# Altium schematic sheet UserInterface.SchDoc
size A
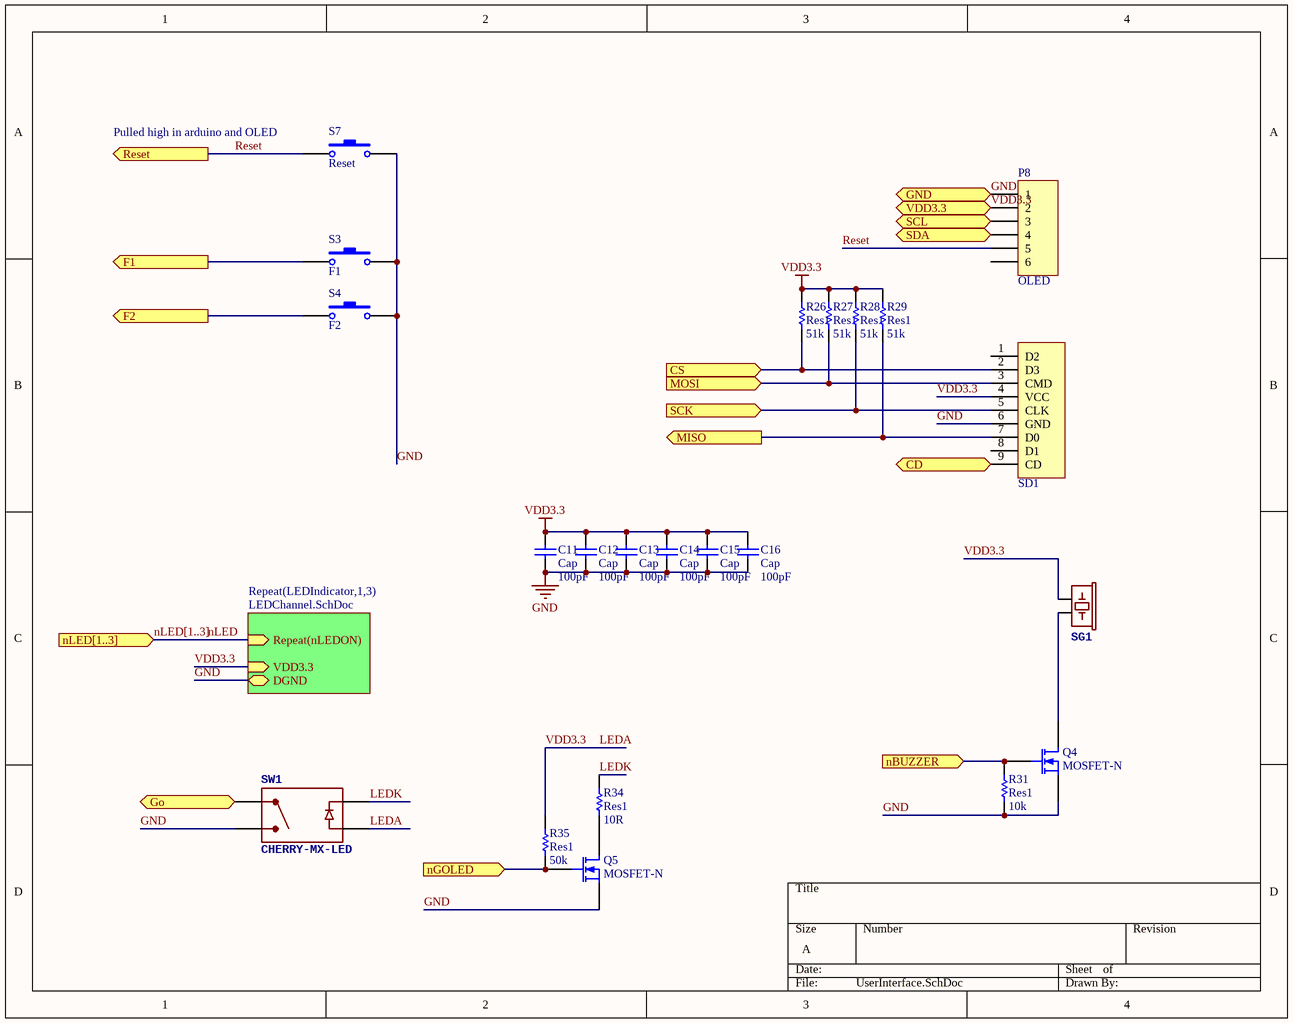
[diagram p0: UserInterface.SchDoc]

## Parts
C11  Cap  value 100pF  [CAP_0805]
C12  Cap  value 100pF  [CAP_0805]
C13  Cap  value 100pF  [CAP_0805]
C14  Cap  value 100pF  [CAP_0805]
C15  Cap  value 100pF  [CAP_0805]
C16  Cap  value 100pF  [CAP_0805]
P8  OLED  [OLEd]
Q4  MOSFET-N  [SOT23-3]
Q5  MOSFET-N  [SOT23-3]
R26  Res1  value 51k  [RES_0805]
R27  Res1  value 51k  [RES_0805]
R28  Res1  value 51k  [RES_0805]
R29  Res1  value 51k  [RES_0805]
R31  Res1  value 10k  [RES_0805]
R34  Res1  value 10R  [RES_0805]
R35  Res1  value 50k  [RES_0805]
S3  F1  [ButtonTACT_3x6x2.5_180]
S4  F2  [ButtonTACT_3x6x2.5_180]
S7  Reset  [ButtonTACT_3x6x2.5_180]
SD1  SD_Card_TF  [SD_Card_TF]  (value not drawn)
SG1  Buzzer 12mmSpark Fun Electronics SKU : Comp-Buzzer  [Buzzer_5x5]  (value not drawn)
SW1  CHERRY-MX-LED  [MX-LED]

## Sub-sheets
Repeat(LEDIndicator,1,3) = LEDChannel.SchDoc: DGND, VDD3.3 (in), Repeat(nLEDON) (in)

## Ports
CD (out), CS (in), F1 (out), F2 (out), GND, Go (out), MISO (out), MOSI (in), nBUZZER (in), nGOLED (in), nLED[1..3] (in), Reset (out), SCK (in), SCL (bidir), SDA (bidir), VDD3.3

## Nets
GND: C11.1 C12.1 C13.1 C14.1 C15.1 C16.1 P8.1 Q4.3(S) Q5.3(S) R31.1 S3.2 S4.2 S7.2 SD1.6(GND) SW1.P$2 ; port GND, sheet Repeat(LEDIndicator,1,3)/DGND
LEDA: C11.2 C12.2 C13.2 C14.2 C15.2 C16.2 P8.2 R26.2 R27.2 R28.2 R29.2 R35.2 SD1.4(VCC) SG1.+ SW1.P$4 ; port VDD3.3, sheet Repeat(LEDIndicator,1,3)/VDD3.3  [also labelled VDD3.3]
CD: SD1.9(CD) ; port CD
CS: R26.1 SD1.2(D3) ; port CS
F1: S3.1 ; port F1
F2: S4.1 ; port F2
Go: SW1.P$1 ; port Go
LEDK: R34.2 SW1.P$3
MISO: R29.1 SD1.7(D0) ; port MISO
MOSI: R27.1 SD1.3(CMD) ; port MOSI
nBUZZER: Q4.2(G) R31.2 ; port nBUZZER
nGOLED: Q5.2(G) R35.1 ; port nGOLED
nLED: sheet Repeat(LEDIndicator,1,3)/Repeat(nLEDON)
Reset: P8.5 S7.1 ; port Reset
SCK: R28.1 SD1.5(CLK) ; port SCK
SCL: P8.3 ; port SCL
SDA: P8.4 ; port SDA
NetQ4_1: Q4.1(D) SG1.-
NetQ5_1: Q5.1(D) R34.1

Not connected (* = marked no-connect by the designer): P8 6; SD1 1(D2) 8(D1)

## Buses and harness runs
bus nLED[1..3] = port nLED[1..3]

## Notes on the sheet
- (near S7) Pulled high in arduino and OLED

## Library data of the parts
C11-C16 = Cap: Capacitor; Published: 8-Jun-2000; LatestRevisionDate: 17-Jul-2002; LatestRevisionNote: Re-released for DXP Platform.; PackageReference: RAD-0.3; Publisher: Altium Limited; PackageDescription: Radial Cap, Thru-Hole; 2 Leads; 0.3 in Pin Spacing
P8 = Header 6: Header, 6-Pin; LatestRevisionDate: 17-Jul-2002; LatestRevisionNote: Re-released for DXP Platform.; Publisher: Altium Limited
Q4 Q5 = MOSFET-N: N-Channel MOSFET; pin to pad: 1>3 2>1 3>2; Published: 8-Jun-2000; LatestRevisionDate: 17-Jul-2002; LatestRevisionNote: Re-released for DXP Platform.; PackageVersion: 1995/1996; PackageReference: E3; Publisher: Altium Limited; PackageDescription: TO, Flat Index; 3 In-Line, Axial Leads; Body Dia. 4.6mm; Lead Dia. 0.5 mm (max)
R26-R29 R31 R34 R35 = Res1: Resistor; Published: 8-Jun-2000; LatestRevisionDate: 17-Jul-2002; LatestRevisionNote: Re-released for DXP Platform.; PackageReference: AXIAL-0.3; Publisher: Altium Limited; PackageDescription: Axial Device, Thru-Hole; 2 Leads; 0.3 in Pin Spacing
S3 S4 S7 = SW-PB: Switch; Published: 24-Mar-1999; LatestRevisionDate: 17-Jul-2002; LatestRevisionNote: Re-released for DXP Platform.; PackageReference: SPST-2; Publisher: Altium Limited; PackageDescription: Switch; 2 Leads
SD1 = SD_Card_TF: SD
SG1 = BUZZERPTH: pin to pad: +>P ->N